# Altium schematic sheet Power Delivery.SchDoc: Power Delivery
size A4; Date: Dec. 28th, 2022; Author: Karl Asseily; DrawnBy: Karl Asseily; DocumentNumber: 202301111111; Revision: 1.2; SheetNumber: 4; SheetTotal: 20; Time: 18:58
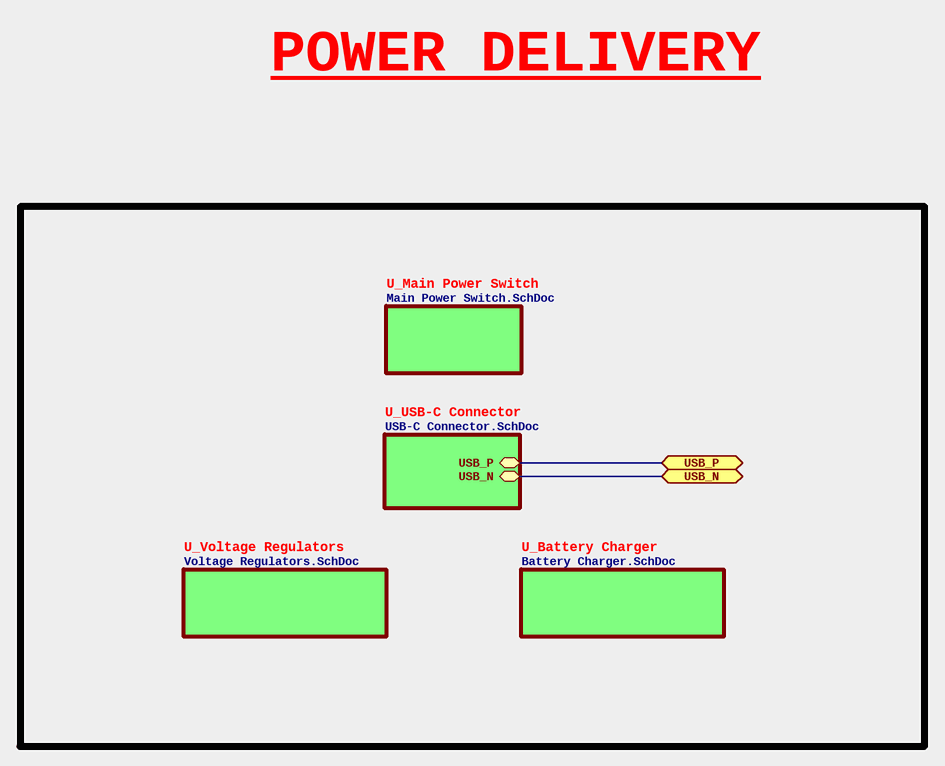
[diagram p0: Power Delivery.SchDoc]

## Sub-sheets
U_Battery Charger = Battery Charger.SchDoc: no entries
U_Main Power Switch = Main Power Switch.SchDoc: no entries
U_USB-C Connector = USB-C Connector.SchDoc: USB_N (bidir), USB_P (bidir)
U_Voltage Regulators = Voltage Regulators.SchDoc: no entries

## Ports
USB_N (bidir, see Cellar Watchdog, USB-C Connector, USB-to-Serial Converter), USB_P (bidir, see Cellar Watchdog, USB-C Connector, USB-to-Serial Converter)

## Nets
USB_N: port USB_N, sheet U_USB-C Connector/USB_N
USB_P: port USB_P, sheet U_USB-C Connector/USB_P

## Notes on the sheet
- POWER DELIVERY
- Project
- Sheet
- Size
- Filename
- A4
- of
- Number
- Drawn By
- Rev.
- Variant
- Date